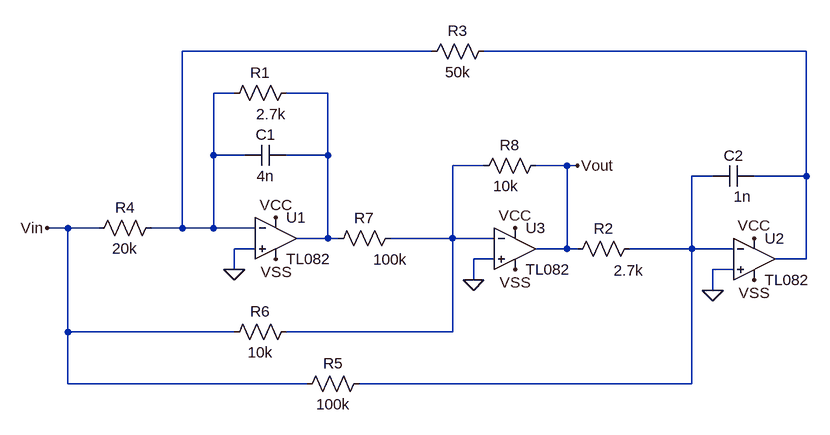
[diagram p0: schematic SimComum.asc]
SimComum.asc, the LTspice schematic file:
Version 4
SHEET 1 880 680
WIRE 80 -144 -304 -144
WIRE 656 -144 160 -144
WIRE -224 -80 -256 -80
WIRE -80 -80 -144 -80
WIRE -256 16 -256 -80
WIRE -208 16 -256 16
WIRE -80 16 -80 -80
WIRE -80 16 -144 16
WIRE 160 32 112 32
WIRE 288 32 240 32
WIRE 304 32 288 32
WIRE 512 48 480 48
WIRE 656 48 656 -144
WIRE 656 48 576 48
WIRE -480 128 -512 128
WIRE -432 128 -480 128
WIRE -304 128 -304 -144
WIRE -304 128 -352 128
WIRE -256 128 -256 16
WIRE -256 128 -304 128
WIRE -192 128 -256 128
WIRE -80 144 -80 16
WIRE -80 144 -128 144
WIRE -64 144 -80 144
WIRE 112 144 112 32
WIRE 112 144 16 144
WIRE 176 144 112 144
WIRE -192 160 -224 160
WIRE 288 160 288 32
WIRE 288 160 240 160
WIRE 304 160 288 160
WIRE 480 160 480 48
WIRE 480 160 384 160
WIRE 544 160 480 160
WIRE 176 176 144 176
WIRE 656 176 656 48
WIRE 656 176 608 176
WIRE -224 192 -224 160
WIRE 544 192 512 192
WIRE 144 208 144 176
WIRE 512 224 512 192
WIRE -480 288 -480 128
WIRE -224 288 -480 288
WIRE 112 288 112 144
WIRE 112 288 -144 288
WIRE -480 368 -480 288
WIRE -112 368 -480 368
WIRE 480 368 480 160
WIRE 480 368 -32 368
FLAG -224 192 0
FLAG 144 208 0
FLAG 512 224 0
FLAG -512 128 Vin
FLAG 304 32 Vout
FLAG -160 112 VCC
FLAG 208 128 VCC
FLAG 576 144 VCC
FLAG -160 176 VSS
FLAG 208 192 VSS
FLAG 576 208 VSS
SYMBOL res -128 -96 R90
WINDOW 0 0 56 VBottom 2
WINDOW 3 33 39 VTop 2
SYMATTR InstName R1
SYMATTR Value 2.7k
SYMBOL res 400 144 R90
WINDOW 0 0 56 VBottom 2
WINDOW 3 34 17 VTop 2
SYMATTR InstName R2
SYMATTR Value 2.7k
SYMBOL res 176 -160 R90
WINDOW 0 0 56 VBottom 2
WINDOW 3 32 56 VTop 2
SYMATTR InstName R3
SYMATTR Value 50k
SYMBOL res -336 112 R90
WINDOW 0 0 56 VBottom 2
WINDOW 3 32 56 VTop 2
SYMATTR InstName R4
SYMATTR Value 20k
SYMBOL res -16 352 R90
WINDOW 0 0 56 VBottom 2
WINDOW 3 32 56 VTop 2
SYMATTR InstName R5
SYMATTR Value 100k
SYMBOL res -128 272 R90
WINDOW 0 0 56 VBottom 2
WINDOW 3 32 56 VTop 2
SYMATTR InstName R6
SYMATTR Value 10k
SYMBOL res 32 128 R90
WINDOW 0 0 56 VBottom 2
WINDOW 3 33 16 VTop 2
SYMATTR InstName R7
SYMATTR Value 100k
SYMBOL res 256 16 R90
WINDOW 0 0 56 VBottom 2
WINDOW 3 32 62 VTop 2
SYMATTR InstName R8
SYMATTR Value 10k
SYMBOL cap -144 0 R90
WINDOW 0 0 32 VBottom 2
WINDOW 3 32 32 VTop 2
SYMATTR InstName C1
SYMATTR Value 4n
SYMBOL cap 576 32 R90
WINDOW 0 0 32 VBottom 2
WINDOW 3 32 18 VTop 2
SYMATTR InstName C2
SYMATTR Value 1n
SYMBOL Opamps\\opamp2 -160 80 R0
SYMATTR InstName U1
SYMATTR Value TL082
SYMBOL Opamps\\opamp2 576 112 R0
SYMATTR InstName U2
SYMATTR Value TL082
SYMBOL Opamps\\opamp2 208 96 R0
SYMATTR InstName U3
SYMATTR Value TL082

The netlist it stands for:
* SimComum.asc
R1 N003 N001 2.7k
R2 N005 Vout 2.7k
R3 N002 N001 50k
R4 N001 Vin 20k
R5 N005 Vin 100k
R6 N004 Vin 10k
R7 N004 N003 100k
R8 Vout N004 10k
C1 N003 N001 4n
C2 N002 N005 1n
XU1 0 N001 VCC VSS N003 TL082  ; pins In+ In- V+ V- OUT
XU2 0 N005 VCC VSS N002 TL082  ; pins In+ In- V+ V- OUT
XU3 0 N004 VCC VSS Vout TL082  ; pins In+ In- V+ V- OUT
.backanno
.end